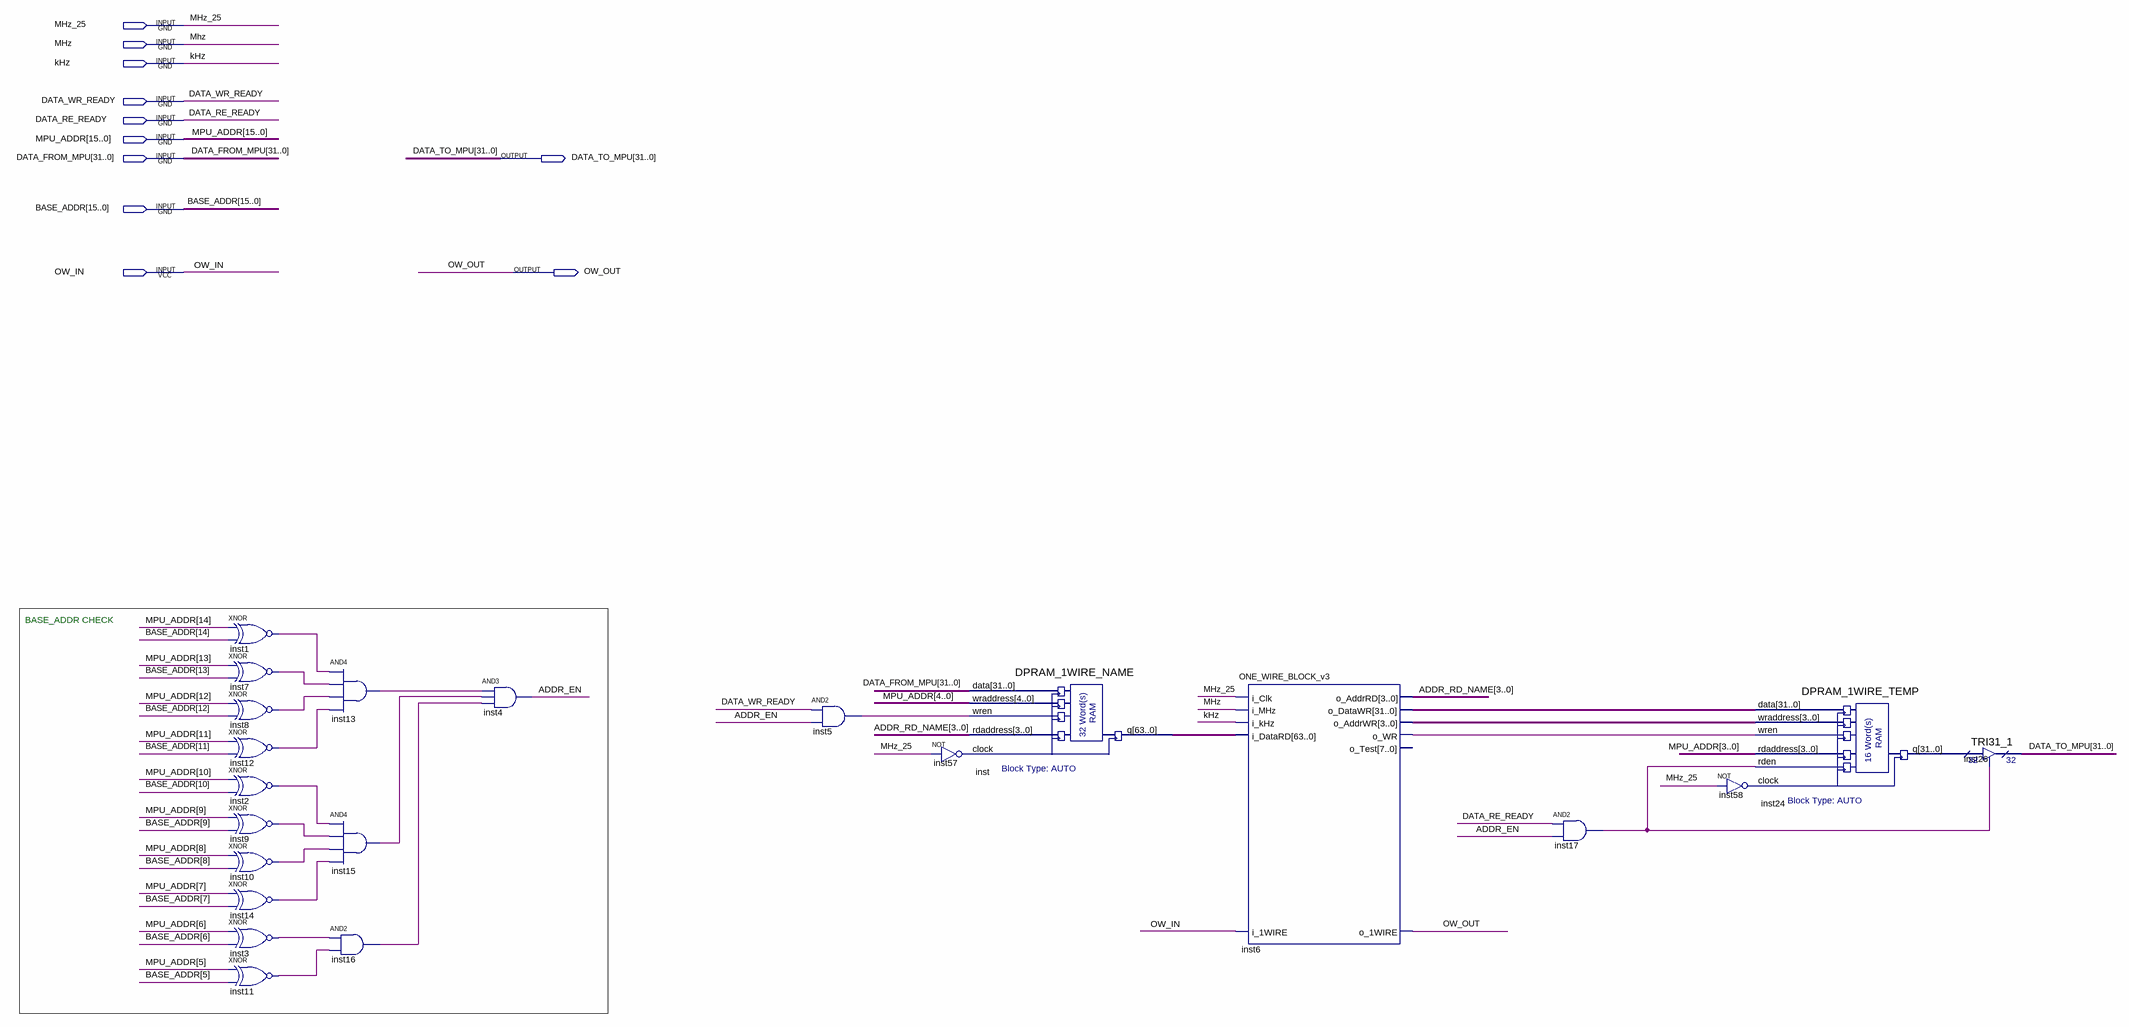
[diagram p0: schematic sheet]
// Quartus schematic ONE_WIRE_MODULE.bdf as structural Verilog: 22 symbols, 11 pins
module ONE_WIRE_MODULE (
  input  MHz_25,
  input  MHz,
  input  kHz,
  input  DATA_WR_READY,
  input  DATA_RE_READY,
  input  [15:0] MPU_ADDR,
  input  [31:0] DATA_FROM_MPU,
  input  [15:0] BASE_ADDR,
  input  OW_IN,
  output [31:0] DATA_TO_MPU,
  output OW_OUT
);

  wire ADDR_EN, inst1_out, inst2_out, inst3_out, inst5_out, inst6_o_wr, inst7_out, inst8_out, inst9_out,
       inst10_out, inst11_out, inst12_out, inst13_out, inst14_out, inst15_out, inst16_out, inst17_out,
       inst57_out, inst58_out;
  wire [3:0] ADDR_RD_NAME, inst6_o_addrwr;
  wire [31:0] inst6_o_datawr, inst24_q;
  wire [63:0] inst_q;

  xnor inst1 (inst1_out, MPU_ADDR[14], BASE_ADDR[14]);
  xnor inst7 (inst7_out, MPU_ADDR[13], BASE_ADDR[13]);
  xnor inst8 (inst8_out, MPU_ADDR[12], BASE_ADDR[12]);
  xnor inst12 (inst12_out, MPU_ADDR[11], BASE_ADDR[11]);
  xnor inst2 (inst2_out, MPU_ADDR[10], BASE_ADDR[10]);
  xnor inst9 (inst9_out, MPU_ADDR[9], BASE_ADDR[9]);
  xnor inst10 (inst10_out, MPU_ADDR[8], BASE_ADDR[8]);
  xnor inst14 (inst14_out, MPU_ADDR[7], BASE_ADDR[7]);
  xnor inst3 (inst3_out, MPU_ADDR[6], BASE_ADDR[6]);
  xnor inst11 (inst11_out, MPU_ADDR[5], BASE_ADDR[5]);
  and inst13 (inst13_out, inst1_out, inst7_out, inst8_out, inst12_out);
  and inst15 (inst15_out, inst2_out, inst9_out, inst10_out, inst14_out);
  and inst16 (inst16_out, inst3_out, inst11_out);
  and inst4 (ADDR_EN, inst13_out, inst15_out, inst16_out);
  and inst5 (inst5_out, DATA_WR_READY, ADDR_EN);
  not inst57 (inst57_out, MHz_25);
  DPRAM_1WIRE_NAME inst (
    .data(DATA_FROM_MPU), .wraddress(MPU_ADDR[4:0]), .wren(inst5_out), .rdaddress(ADDR_RD_NAME),
    .clock(inst57_out), .q(inst_q));
  ONE_WIRE_BLOCK_v3 inst6 (
    .i_Clk(MHz_25), .i_MHz(MHz), .i_kHz(kHz), .i_DataRD(inst_q), .i_1WIRE(OW_IN), .o_AddrRD(ADDR_RD_NAME),
    .o_DataWR(inst6_o_datawr), .o_AddrWR(inst6_o_addrwr), .o_WR(inst6_o_wr), .o_1WIRE(OW_OUT));  // open: o_Test
  and inst17 (inst17_out, DATA_RE_READY, ADDR_EN);
  DPRAM_1WIRE_TEMP inst24 (
    .data(inst6_o_datawr), .wraddress(inst6_o_addrwr), .wren(inst6_o_wr), .rdaddress(MPU_ADDR[3:0]),
    .rden(inst17_out), .clock(inst58_out), .q(inst24_q));
  not inst58 (inst58_out, MHz_25);
  TRI31_1 inst26 (.enabledt(inst17_out), .data(inst24_q), .tridata(DATA_TO_MPU));

  // Notes on the sheet:
  //   BASE_ADDR CHECK
endmodule
